# EAGLE design DrivewayLights (EAGLE 7.6.0)
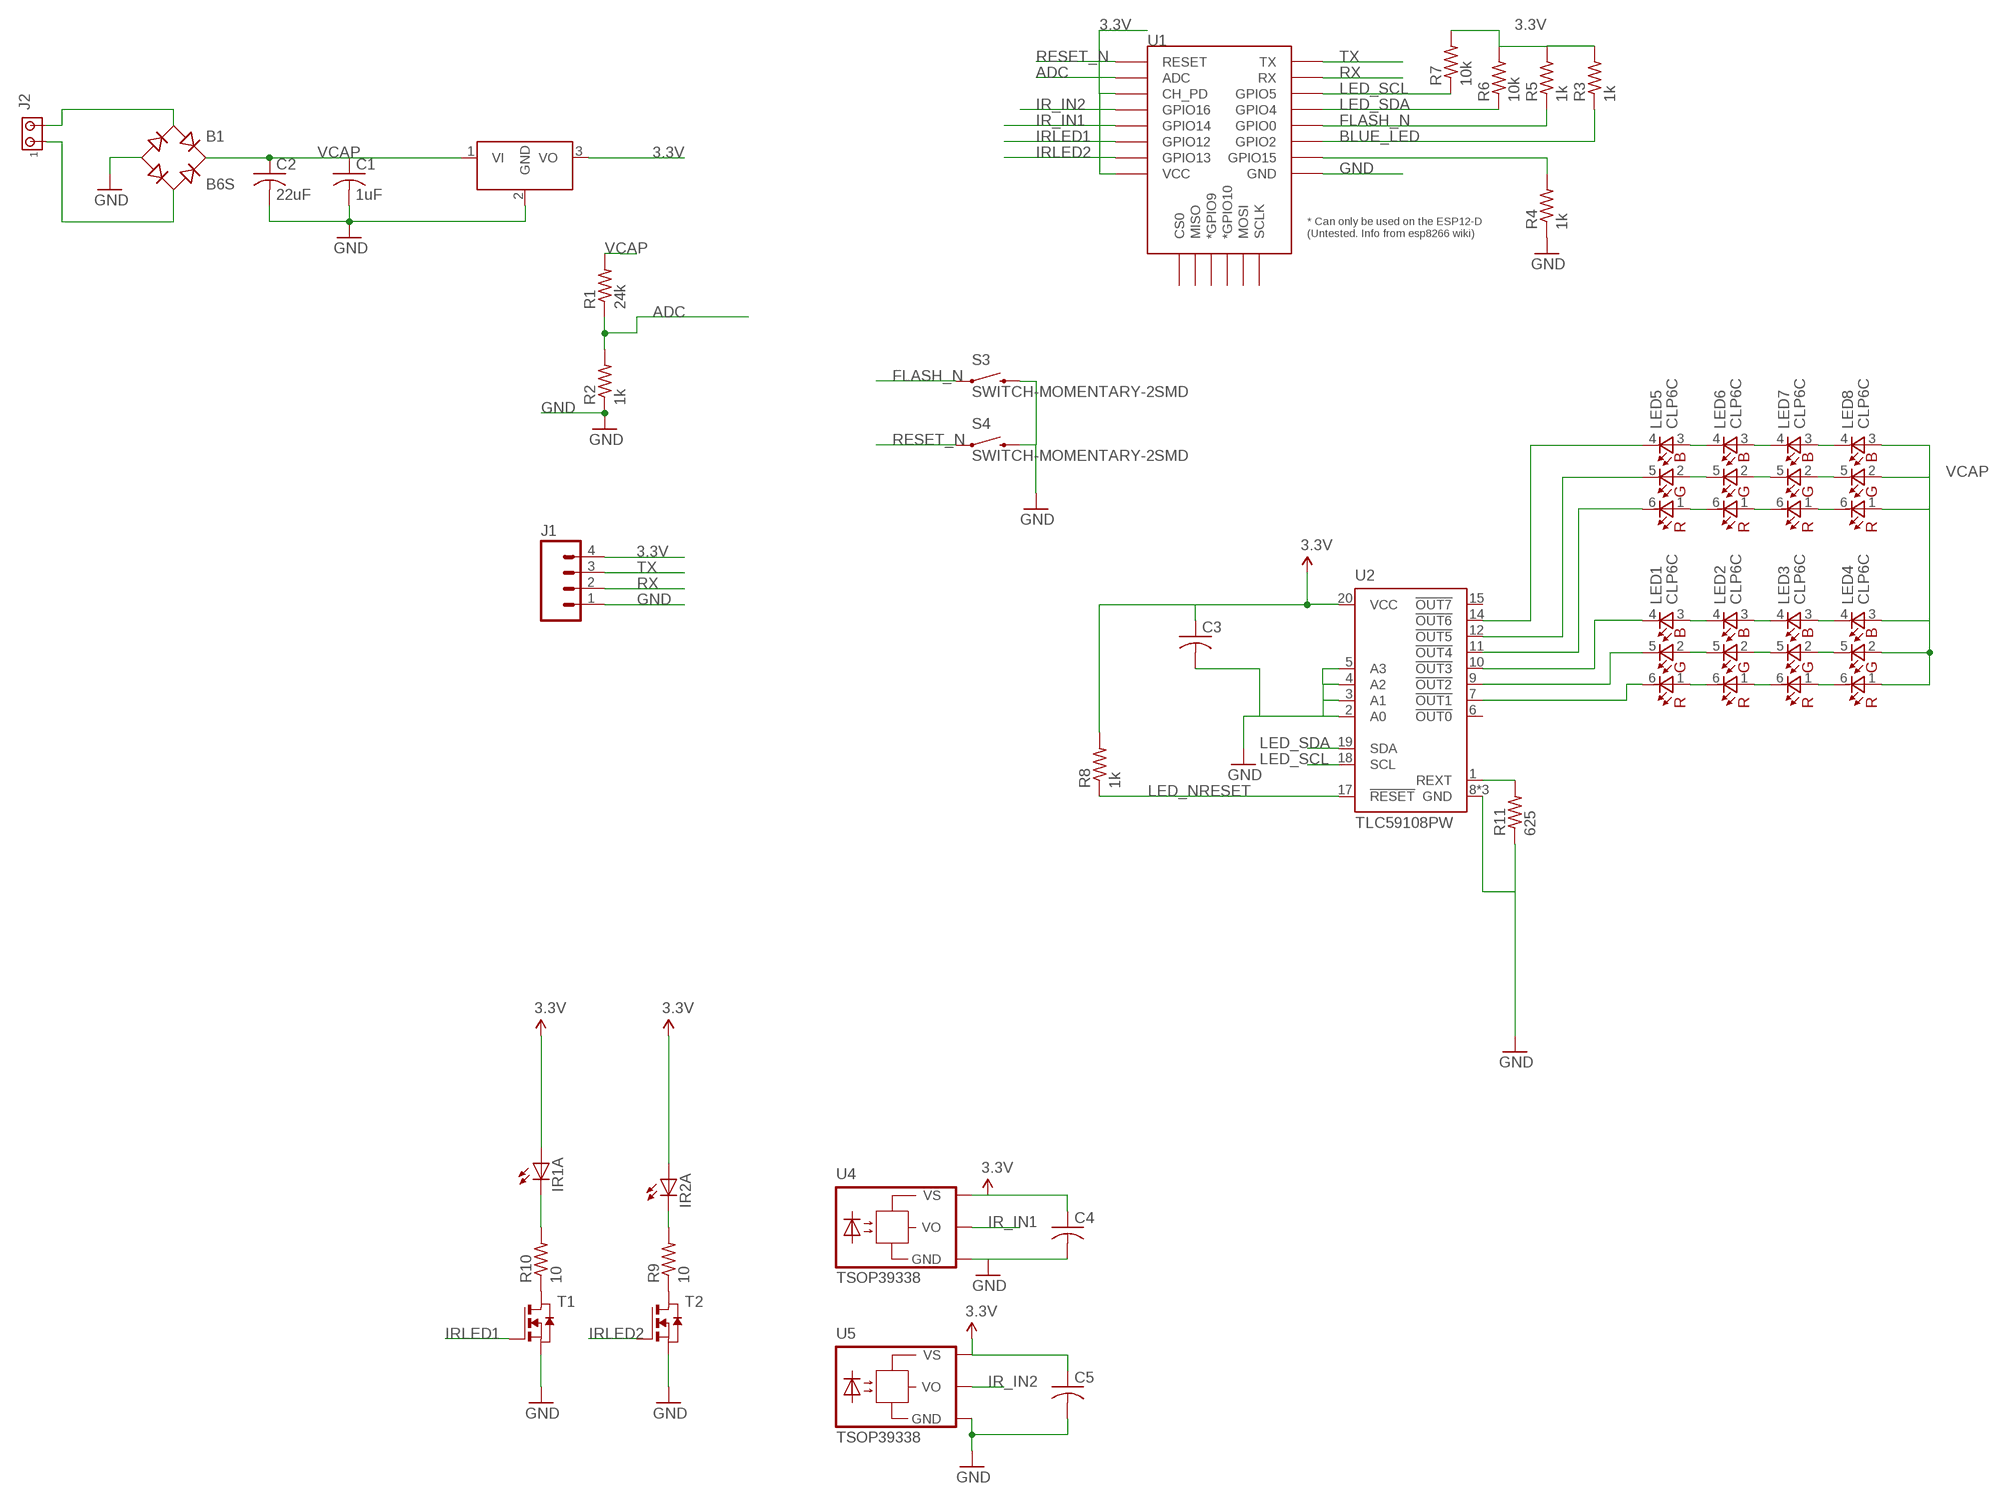
[diagram p0: schematic, sheet 1]

## Parts
B1  B6S  [MBS]
C1  1uF  C-USC0805  [C0805]
C2  22uF  C-USC1210  [C1210]
C3  C-USC0603  [C0603]
C4  C-USC0603  [C0603]
C5  C-USC0603  [C0603]
IR1A  LED5MM  [LED5MM]
IR2A  LED5MM  [LED5MM]
J1  M04JST-PTH-VERT  [JST-4-PTH-VERT]
J2  MTA02-100  [10X02MTA]
LED1  CLP6C  [CLP6C]
LED2  CLP6C  [CLP6C]
LED3  CLP6C  [CLP6C]
LED4  CLP6C  [CLP6C]
LED5  CLP6C  [CLP6C]
LED6  CLP6C  [CLP6C]
LED7  CLP6C  [CLP6C]
LED8  CLP6C  [CLP6C]
R1  24k  R-US_R0603  [R0603]
R2  1k  R-US_R0603  [R0603]
R3  1k  R-US_R0603  [R0603]
R4  1k  R-US_R0603  [R0603]
R5  1k  R-US_R0603  [R0603]
R6  10k  R-US_R0603  [R0603]
R7  10k  R-US_R0603  [R0603]
R8  1k  R-US_R0603  [R0603]
R9  10  R-US_R0603  [R0603]
R10  10  R-US_R0603  [R0603]
R11  625  R-US_R0603  [R0603]
S3  SWITCH-MOMENTARY-2SMD  [TACTILE-SWITCH-SMD]
S4  SWITCH-MOMENTARY-2SMD  [TACTILE-SWITCH-SMD]
T1  NMOSSOT23  [SOT-23]
T2  NMOSSOT23  [SOT-23]
U1  ESP12ESMD  [ESP12E-SMD]
U2  TLC59108PW  [PW_R-PDSO-G20]
U3  DCDC_OKI-78SR  [OKI-78SRH]
U4  TSOP39338  [TSOP39338]
U5  TSOP39338  [TSOP39338]

## Nets
3.3V: C3.1 C4.1 C5.1 IR1A.A IR2A.A J1.4 R3.2 R5.2 R6.2 R7.2 R8.2 U1.CH_PD U1.VCC U2.20(VCC) U3.3(VO) U4.VS U5.VS
ADC: R1.1 R2.2 U1.ADC
BLUE: LED1.4(BC) U2.10(!OUT3)
BLUE2: LED5.4(BC) U2.14(!OUT6)
BLUE_LED: R3.1 U1.GPIO2
FLASH_N: R5.1 S3.1 U1.GPIO0
GND: B1.- C1.2 C2.2 C3.2 C4.2 C5.2 J1.1 R2.1 R4.1 R11.1 S3.3 S4.3 T1.2(S) T2.2(S) U1.GND U2.2(A0) U2.3(A1) U2.4(A2) U2.5(A3) U2.8(GND) U2.13(GND) U2.16(GND) U3.2(GND) U4.GND U5.GND
GREEN: LED1.5(GC) U2.9(!OUT2)
GREEN2: LED5.5(GC) U2.12(!OUT5)
IR_IN1: U1.GPIO14 U4.OUT(VO)
IR_IN2: U1.GPIO16 U5.OUT(VO)
IRLED0: R4.2 U1.GPIO15
IRLED1: T1.3(G) U1.GPIO12
IRLED2: T2.3(G) U1.GPIO13
LED_CURRENT_R: R11.2 U2.1(REXT)
LED_NRESET: R8.1 U2.17(!RESET)
LED_SCL: R7.1 U1.GPIO5 U2.18(SCL)
LED_SDA: R6.1 U1.GPIO4 U2.19(SDA)
N$2: IR2A.K(C) R9.2
N$5: IR1A.K(C) R10.2
N$6: R10.1 T1.1(D)
N$9: R9.1 T2.1(D)
N$12: LED5.3(BA) LED6.4(BC)
N$13: LED6.3(BA) LED7.4(BC)
N$14: LED7.3(BA) LED8.4(BC)
N$15: LED7.2(GA) LED8.5(GC)
N$16: LED6.2(GA) LED7.5(GC)
N$17: LED5.2(GA) LED6.5(GC)
N$18: LED5.1(RA) LED6.6(RC)
N$20: LED6.1(RA) LED7.6(RC)
N$21: LED7.1(RA) LED8.6(RC)
N$25: LED1.3(BA) LED2.4(BC)
N$26: LED2.3(BA) LED3.4(BC)
N$27: LED3.3(BA) LED4.4(BC)
N$28: LED3.2(GA) LED4.5(GC)
N$29: LED2.2(GA) LED3.5(GC)
N$30: LED1.2(GA) LED2.5(GC)
N$31: LED1.1(RA) LED2.6(RC)
N$32: LED2.1(RA) LED3.6(RC)
N$33: LED3.1(RA) LED4.6(RC)
N$39: B1.AC1 J2.2
N$40: B1.AC2 J2.1
RED: LED1.6(RC) U2.7(!OUT1)
RED2: LED5.6(RC) U2.11(!OUT4)
RESET_N: S4.1 U1.RESET
RX: J1.2 U1.RXD0(RX)
TX: J1.3 U1.TXD0(TX)
VCAP: B1.+ C1.1 C2.1 LED4.1(RA) LED4.2(GA) LED4.3(BA) LED8.1(RA) LED8.2(GA) LED8.3(BA) R1.2 U3.1(VI)
Unconnected: U1.CS0 U1.GPIO9(*GPIO9) U1.GPIO10(*GPIO10) U1.MISO U1.MOSI U1.SCLK U2.6(!OUT0) U2.15(!OUT7)

## Library data of the parts
B1 = rectifier:B*S: Surface Mount Glass Passivated Bridge Rectifiers Source: Comchip Bridge Rectifiers B05S-G_B10S-G.pdf
C1-C5 = rcl:C-US: CAPACITOR, American symbol
IR1A IR2A = led:LED: LED OSRAM: - CHIPLED LG R971, LG N971, LY N971, LG Q971, LY Q971, LO R971, LY R971 LH N974, LH R974 LS Q976, LO Q976, LY Q976 LO Q996 - Hyper CHIPLED LW Q18S LB Q993, LB Q99A, LB R99A - SideLED LS A670, LO A670, LY A670, LG A670, LP A670 LB A673, LV A673, LT A673, LW A673 LH A674 LY A675 LS A676, LA A676, LO A676, LY A676, LW A676 LS A679, LY A679, LG A679 - Hyper Micro SIDELED® LS Y876, LA Y876, LO Y876, LY Y876 LT Y87S - SmartLED LW L88C, LW L88S LB L89C, LB L89S, LG L890 LS L89K, LO L89K, LY L89K LS L896, LA L896, LO L896, LY L896 - TOPLED LS T670, LO T670, LY T670, LG T670, LP T670 LSG T670, LSP T670, LSY T670, LOP T670, LYG T670 LG T671, LOG T671, LSG T671 LB T673, LV T673, LT T673, LW T673 LH T674 LS T676, LA T676, LO T676, LY T676, LB T676, LH T676, LSB T676, LW T676 LB T67C, LV T67C, LT T67C, LS T67K, LO T67K, LY T67K, LW E67C LS E67B, LA E67B, LO E67B, LY E67B, LB E67C, LV E67C, LT E67C LW T67C LS T679, LY T679, LG T679 LS T770, LO T770, LY T770, LG T770, LP T770 LB T773, LV T773, LT T773, LW T773 LH T774 LS E675, LA E675, LY E675, LS T675 LS T776, LA T776, LO T776, LY T776, LB T776 LHGB T686 LT T68C, LB T68C - Hyper Mini TOPLED® LB M676 - Mini TOPLED Santana® LG M470 LS M47K, LO M47K, LY M47K Source: http://www.osram.convergy.de LUXEON: - LUMILED® LXK2-PW12-R00, LXK2-PW12-S00, LXK2-PW14-U00, LXK2-PW14-V00 LXK2-PM12-R00, LXK2-PM12-S00, LXK2-PM14-U00 LXK2-PE12-Q00, LXK2-PE12-R00, LXK2-PE12-S00, LXK2-PE14-T00, LXK2-PE14-U00 LXK2-PB12-K00, LXK2-PB12-L00, LXK2-PB12-M00, LXK2-PB14-N00, LXK2-PB14-P00, LXK2-PB14-Q00 LXK2-PR12-L00, LXK2-PR12-M00, LXK2-PR14-Q00, LXK2-PR14-R00 LXK2-PD12-Q00, LXK2-PD12-R00, LXK2-PD12-S00 LXK2-PH12-R00, LXK2-PH12-S00 LXK2-PL12-P00, LXK2-PL12-Q00, LXK2-PL12-R00 Source: www.luxeon.com KINGBRIGHT: KA-3528ASYC Source: www.kingbright.com
J1 = SparkFun-Connectors:M04: Header 4 Standard 4-pin 0.1" header. Use with straight break away headers (SKU : PRT-00116), right angle break away headers (PRT-00553), swiss pins (PRT-00743), machine pins (PRT-00117), and female headers (PRT-00115). Molex polarized connector foot print use with SKU : PRT-08231 with associated crimp pins and housings. 1MM SMD Version SKU: PRT-10208; PROD_ID: CONN-13251
J2 = con-amp:MTA02-100: AMP connector
LED1-LED8 = led:CLP6C; EAGLEUP: PLCC-6-LED
R1-R8 = resistor:R-US_: RESISTOR, American symbol
R9-R11 = rcl:R-US_: RESISTOR, American symbol
S3 S4 = SparkFun-Electromechanical:SWITCH-MOMENTARY-2: Various NO switches- pushbuttons, reed, etc; PROD_ID: SWCH-08247
T1 T2 = zetex:NMOSSOT23: MOS FET; EAGLEUP: SOT23; OC_FARNELL: unknown; OC_NEWARK: unknown
U1 = esp8266modules:ESP12E: ESP12E Module; EAGLEUP: ESP8266-12E
U2 = texas:TLC59108; EAGLEUP: TSSOP20
U3 = rwt-library:DCDC_OKI-78SR: 4.95W DC/DC Converter Manufacturer: Murata Part Number: OKI-78SR-5/1.5-W36H-C OKI-78SR-3.3/1.5-W36H-C
U4 U5 = opto-vishay:TSOP39338

## Board
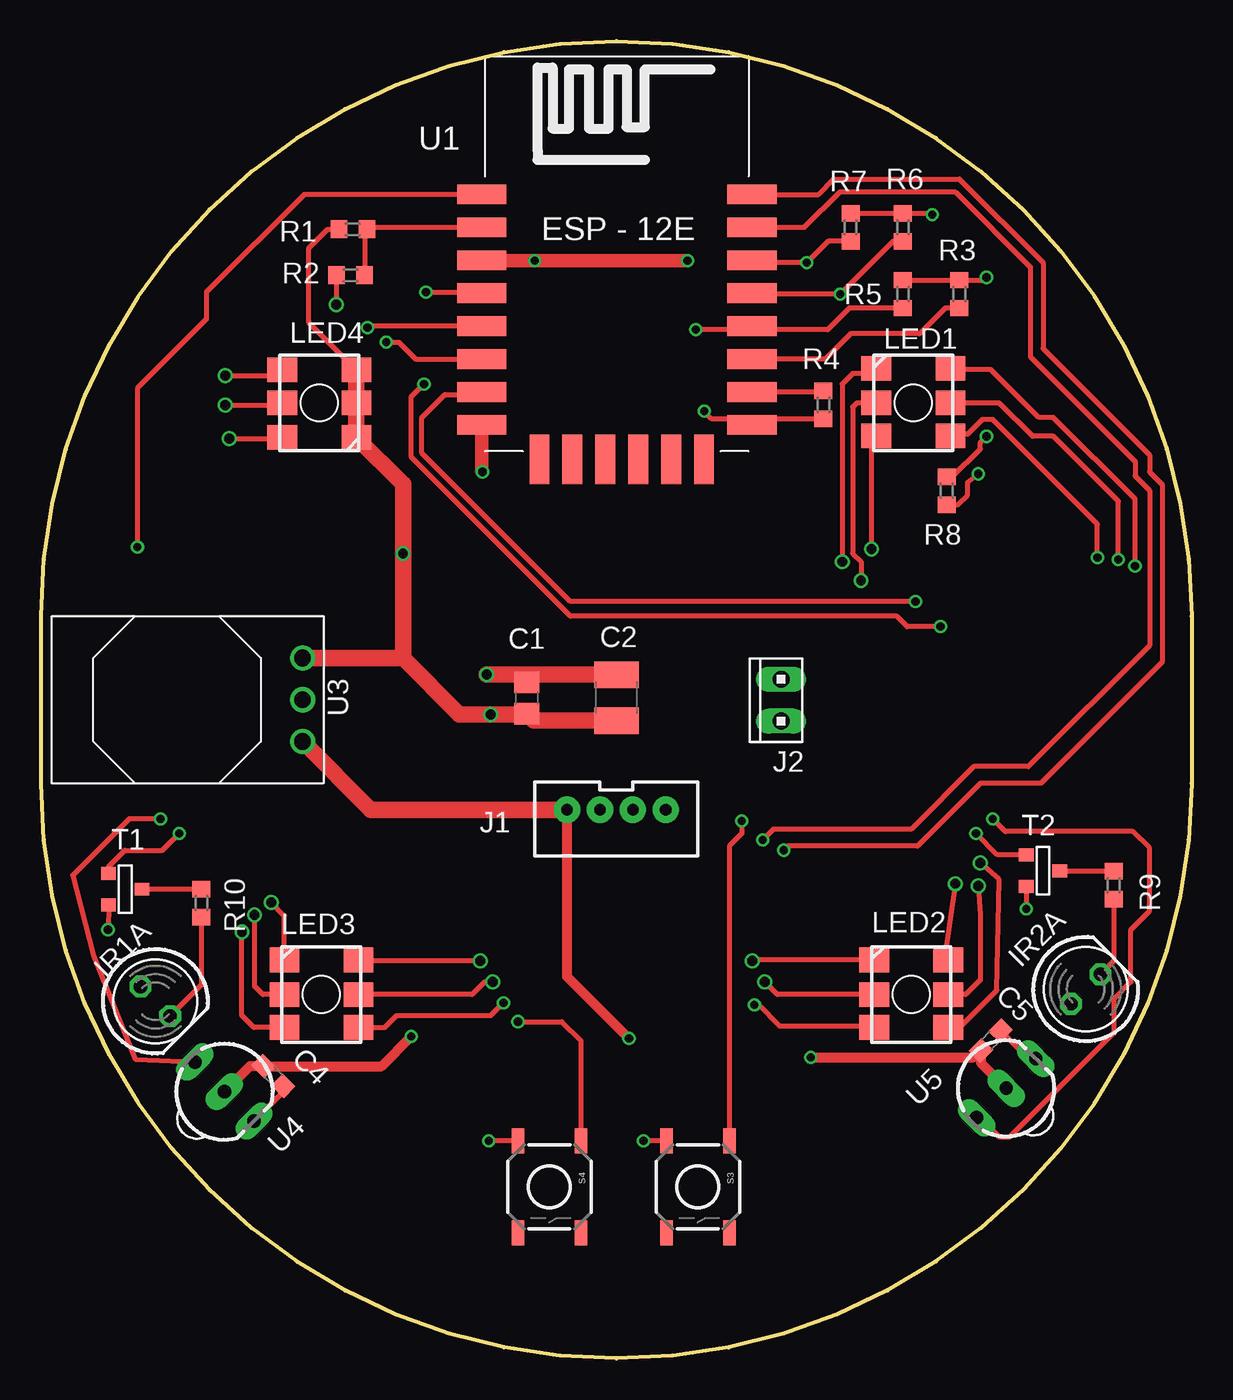
[diagram p1: board, top side]
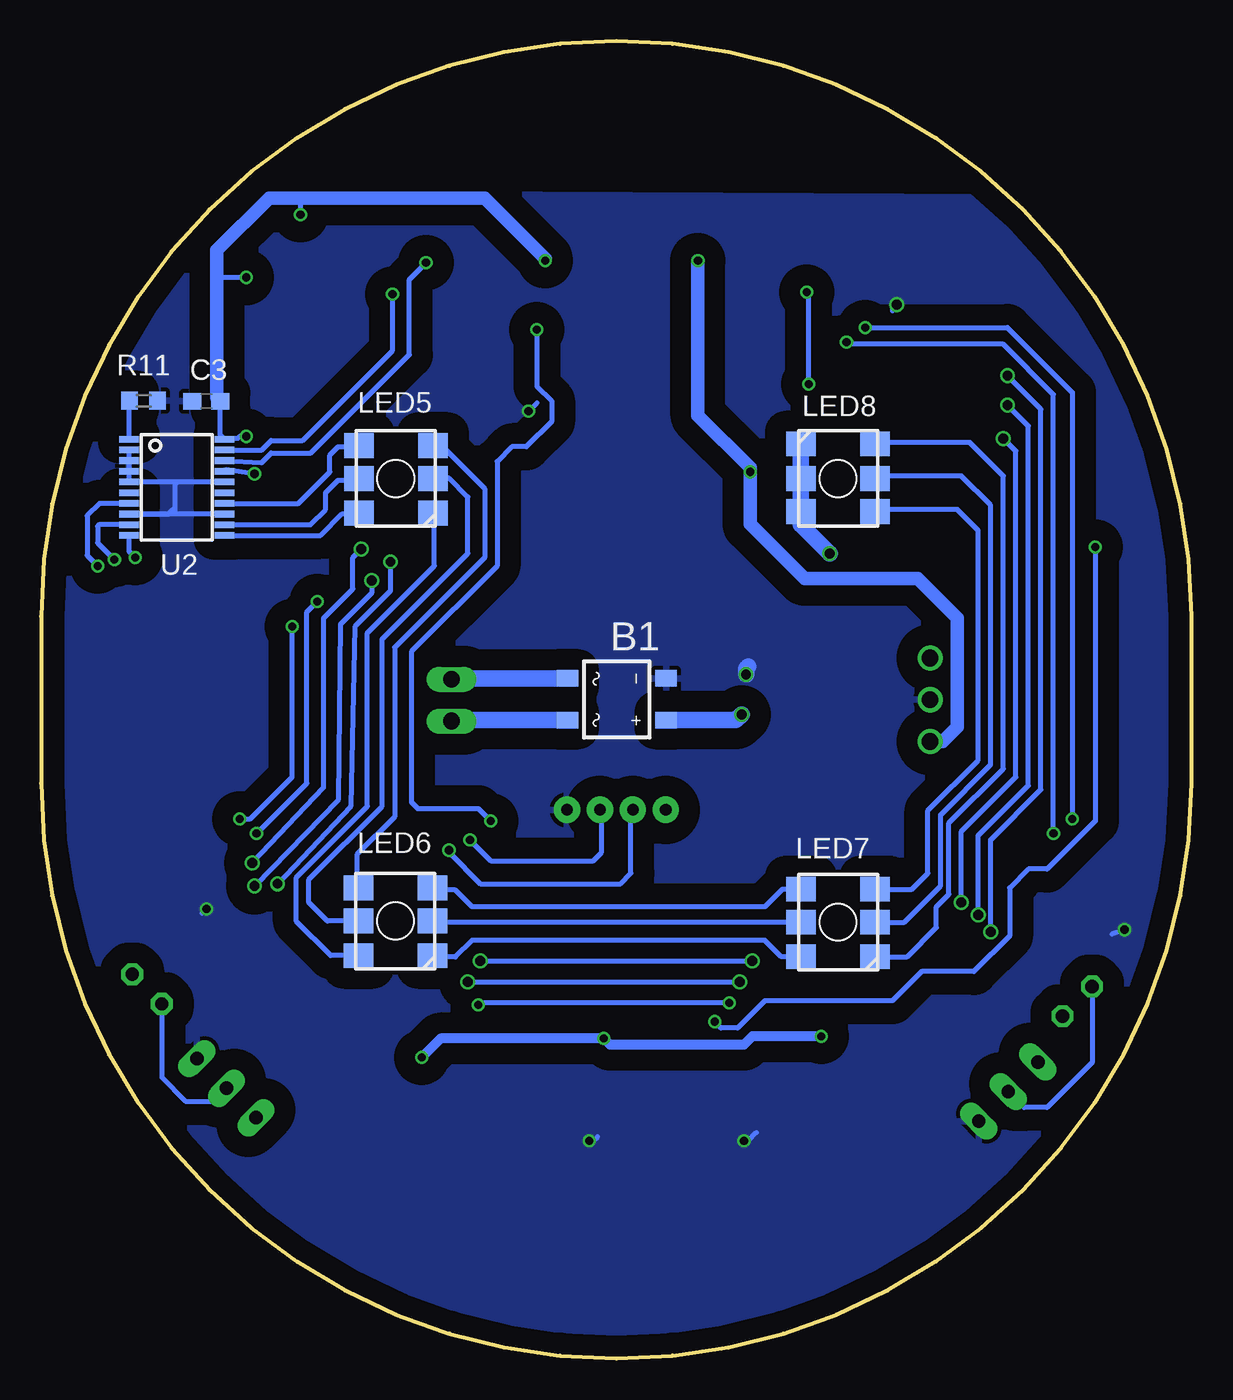
[diagram p2: board, bottom side, seen from below]

Size 69.85 x 80.01 mm. Coordinates in mm from the lower left corner, seen from the top.
Outline: 69.85,34.92 arc-180 0,34.92 0,45.09 arc-180 69.85,45.09 69.85,34.92
Copper layers (1*16): Top 0.035mm / dielectric 1.5mm / Bottom 0.035mm
Design rules "SeeedStudio_2layer_DRU_no_angle_20140221 *": minimum track width 12mil, minimum drill 12mil, track to track 6mil, track to pad 6mil, pad to pad 6mil, via to via 6mil, smd to smd 0mil, copper to edge 10mil, drill to drill 10mil, minimum pad ring 10mil, minimum via ring 6mil, stop-mask expansion 2mil, vias tented up to drill 100mil, thermal gap 10mil

### Footprints (pad centres in the part's own frame; a part is rotated, then mirrored left to right if it is on the bottom)
MBS = smd 1 x 1.3: + -1.27,-3; - 1.27,-3; AC1 -1.27,3; AC2 1.27,3
C0805 = smd 1.3 x 1.5: 1 -0.95,0; 2 0.95,0
C1210 = smd 1.6 x 2.7: 1 -1.4,0; 2 1.4,0
C0603 = smd 1.1 x 1: 1 -0.85,0; 2 0.85,0
LED5MM = drill 0.813 octagon: A -1.27,0; K 1.27,0
JST-4-PTH-VERT = drill 0.7 pad 1.6: 1 -3,-0.55; 2 -1,-0.55; 3 1,-0.55; 4 3,-0.55
10X02MTA = drill 1.016 long: 1 1.27,0; 2 -1.27,0
CLP6C = smd 1.8 x 1.5: 1 -2.25,2.1; 2 -2.25,0; 3 -2.25,-2; 4 2.25,-2; 5 2.25,0; 6 2.25,2.1
R0603 = smd 1 x 1.1: 1 -0.85,0; 2 0.85,0
TACTILE-SWITCH-SMD = smd 1.524 x 0.762: 1 -2.794,1.905; 2 2.794,1.905; 3 -2.794,-1.905; 4 2.794,-1.905
SOT-23 = smd 0.787 x 0.889: 1 0.025,-1.016; 2 -0.94,1.016; 3 0.991,1.016
ESP12E-SMD = smd 3 x 1.2: ADC -8.3,3.8; CH_PD -8.3,1.8; GND 8.1,-8.2; GPIO0 8.1,-2.2; GPIO2 8.1,-4.2; GPIO4 8.1,-0.2; GPIO5 8.1,1.8; GPIO12 -8.3,-4.2; GPIO13 -8.3,-6.2; GPIO14 -8.3,-2.2; GPIO15 8.1,-6.2; GPIO16 -8.3,-0.2; RESET -8.3,5.8; RXD0 8.1,3.8; TXD0 8.1,5.8; VCC -8.3,-8.2 | smd 1.2 x 3: CS0 -4.8,-10.3; GPIO9 -0.8,-10.3; GPIO10 1.2,-10.3; MISO -2.8,-10.3; MOSI 3.2,-10.3; SCLK 5.2,-10.3
PW_R-PDSO-G20 = smd 0.4 x 1.2: 1 -2.925,-2.9; 2 -2.275,-2.9; 3 -1.625,-2.9; 4 -0.975,-2.9; 5 -0.325,-2.9; 6 0.325,-2.9; 7 0.975,-2.9; 8 1.625,-2.9; 9 2.275,-2.9; 10 2.925,-2.9; 11 2.925,2.9; 12 2.275,2.9; 13 1.625,2.9; 14 0.975,2.9; 15 0.325,2.9; 16 -0.325,2.9; 17 -0.975,2.9; 18 -1.625,2.9; 19 -2.275,2.9; 20 -2.925,2.9
OKI-78SRH = drill 1.016: 1 2.54,0; 2 0,0; 3 -2.54,0
TSOP39338 = drill 0.813 long: GND 2.54,0; OUT -2.54,0; VS 0,0

### Placement (x,y rotation side)
B1  34.9,40.03 90 bottom
C1  29.49,40.11 90 top
C2  34.92,40.13 90 top
C3  59.82,58.14 180 bottom
C4  14.1,17.14 315 top
C5  57.66,19.3 45 top
IR1A  6.93,21.69 315 top
IR2A  63.42,22.43 45 top
J1  34.92,32.77 180 top
J2  44.93,39.98 90 top
LED1  52.96,58.04 0 top
LED2  52.83,22.1 0 top
LED3  17.02,22.1 0 top
LED4  16.89,58.04 180 top
LED5  48.31,53.44 180 bottom
LED6  48.34,26.57 180 bottom
LED7  21.46,26.49 180 bottom
LED8  21.46,53.44 0 bottom
R1  18.92,68.58 180 top
R2  18.8,65.79 0 top
R3  55.75,64.64 90 top
R4  47.5,57.91 90 top
R5  52.32,64.64 90 top
R6  52.32,68.71 90 top
R7  49.15,68.71 90 top
R8  54.99,52.7 90 top
R9  65.13,28.73 270 top
R10  9.73,27.66 270 top
R11  63.63,58.17 180 bottom
S3  39.88,10.41 270 top
S4  30.86,10.41 270 top
T1  5.11,28.47 90 top
T2  60.83,29.59 90 top
U1  35.05,64.9 0 top
U2  61.62,52.91 270 bottom
U3  15.88,40.01 90 top
U4  11.13,16.21 315 top
U5  58.6,16.41 45 top

### Tracks (layer width: path | path; a pad name or v marks a point on that pad's centre or on a via)
3.3V  (via drill 0.5)
  Top 0.305: v57.4,65.66 57.24,65.49 R3.2 R5.2 | R7.2 R6.2 54.01,69.56 v54.1,69.47 | R8.2 55.33,53.55 57.02,55.24 57.02,55.63 v57.4,56.01
  Top 0.61: J1.4 31.93,23.19 v35.69,19.43 | v46.74,18.29 56.64,18.29 C5.1 57.06,17.95 U5.VS | U4.VS 12.67,17.75 C4.1 20.67,17.75 v22.48,19.56
  Top 0.813: U1.CH_PD 26.77,66.67 v29.97,66.67 v39.24,66.67 | U1.VCC 26.75,53.89 v26.8,53.85
  Top 1.016: J1.4 20.02,33.32 U3.3
  Bottom 0.305: U2.20 58.97,56.08 C3.1 | 58.64,55.75 U2.20 | IR1A.A 6.04,17.97 8.76,15.24 10.16,15.24 U4.VS | v57.4,65.66 59.05,65.66 59.18,65.79 | v54.1,69.47 54.1,70.48 | IR2A.A 62.53,17.06 61.09,15.62 59.38,15.62 U5.VS | v57.4,56.01 57.78,56.01 57.91,55.88 58.67,55.88 U2.20
  Bottom 0.61: v46.74,18.29 45.59,19.43 v35.69,19.43 35.31,19.05 27.18,19.05 26.67,19.56 v22.48,19.56
  Bottom 0.813: v29.97,66.67 29.97,57.28 26.8,54.1 v26.8,53.85 26.8,50.67 23.5,47.37 16.64,47.37 14.22,44.96 14.22,38.35 15.11,37.47 U3.3 | v39.24,66.67 39.24,66.8 42.93,70.48 54.1,70.48 56.01,70.48 59.18,67.31 59.18,65.79 59.18,58.36 C3.1
ADC
  Top 0.305: R2.2 19.65,68.45 R1.1 19.89,68.7 U1.ADC
BLUE  (via drill 0.5)
  Top 0.305: v64.14,48.64 64.14,50.67 57.78,57.02 57.15,57.02 56.26,56.13 55.3,56.13 LED1.4
  Bottom 0.305: U2.10 64.52,49.03 v64.14,48.64
BLUE2
  Bottom 0.305: U2.14 54.24,51.93 52.32,53.85 52.32,54.86 51.82,55.37 50.63,55.37 LED5.4
BLUE_LED
  Top 0.305: R3.1 54.9,63.79 53.34,62.23 49.15,62.23 47.62,60.71 43.16,60.71 U1.GPIO2
FLASH_N  (via drill 0.5)
  Top 0.305: R5.1 49.06,63.79 47.75,62.48 43.37,62.48 | 43.37,62.48 U1.GPIO0 | 43.37,62.48 v39.75,62.48 | v42.55,32.64 42.55,31.88 41.78,31.11 S3.1
  Bottom 0.305: v39.75,62.48 39.75,59.05 38.86,58.17 38.86,56.9 40.39,55.37 41.27,55.37 42.16,54.48 42.16,48.13 47.37,42.93 47.37,33.78 46.99,33.4 43.31,33.4 v42.55,32.64
GND  (via drill 0.5, 0.6)
  Top 0.305: R2.1 17.91,65.75 v17.91,64.01 | U1.GND 43.52,57.06 | 43.52,57.06 40.73,57.06 v40.26,57.53 | R4.1 43.52,57.06 | T1.2 v4.06,26.04 | C4.2 14.7,16.19 U4.GND | S4.3 v27.18,13.21 | S3.3 v36.58,13.21 | U5.GND 59.96,18.2 C5.2 | T2.2 v59.82,27.3
  Top 1.016: C2.2 29.96,41.53 | 29.96,41.53 C1.2 | 29.96,41.53 v27.05,41.53
  Bottom 0.305: v17.91,64.01 18.16,63.75 18.16,63.63 | U2.13 U2.8 62.13,51.28 61.85,51.56 61.72,51.44 61.72,53.11 61.59,53.23 | U2.16 61.59,53.23 | 61.59,53.23 U2.5 U2.4 U2.3 U2.2 | v40.26,57.53 39.75,58.04 | v4.06,26.04 4.83,25.78 | v27.18,13.21 26.92,13.21 26.42,13.72 | v36.58,13.21 36.32,13.21 36.07,13.46 | v59.82,27.3 60.07,27.05
  Bottom 1.016: v27.05,41.53 27.05,41.91 26.92,42.04
  pour Bottom (isolate 1.27): 1.02,70.48 72.39,70.87 71.12,-4.32 -1.02,-4.32 -1.4,38.61 -12.57,37.85 -12.57,70.36
GREEN  (via drill 0.5)
  Top 0.305: v65.41,48.51 65.41,52.07 61.47,56.01 60.2,56.01 58.17,58.04 LED1.5
  Bottom 0.305: U2.9 66.33,50.63 66.42,50.55 66.42,49.53 v65.41,48.51
GREEN2
  Bottom 0.305: U2.12 53.51,50.63 52.58,51.56 52.58,52.58 51.82,53.34 50.66,53.34 LED5.5
IR_IN1  (via drill 0.5)
  Top 0.305: U1.GPIO14 19.9,62.7 v19.81,62.61 | v7.24,32.77 5.33,32.77 1.91,29.34 3.17,24.51 5.71,18.16 U4.OUT
  Bottom 0.305: v19.81,62.61 11.18,62.61 7.24,58.67 v7.24,32.77
IR_IN2  (via drill 0.5)
  Top 0.305: U5.OUT 57.02,14.61 58.17,13.46 58.8,13.46 65.15,19.81 65.15,21.84 66.17,22.86 66.17,26.04 67.31,27.18 67.31,30.99 66.29,32 58.55,32 v57.78,32.77 | v54.61,44.45 52.58,44.45 51.94,45.09 32.13,45.09 22.48,54.74 22.48,58.42 v23.24,59.18 | v23.37,64.77 26.68,64.77 U1.GPIO16
  Bottom 0.305: v57.78,32.77 57.15,32.77 54.61,35.31 v54.61,44.45 | v23.24,59.18 23.24,64.64 v23.37,64.77
IRLED0
  Top 0.305: R4.2 47.43,58.7 U1.GPIO15
IRLED1  (via drill 0.5)
  Top 0.305: T1.3 4.09,29.87 5.08,30.86 7.37,30.86 v8.38,31.88 | v20.95,61.72 21.72,61.72 22.73,60.71 U1.GPIO12
  Bottom 0.305: v8.38,31.88 8.38,58.55 11.43,61.59 20.83,61.59 v20.95,61.72
IRLED2  (via drill 0.5)
  Top 0.305: T2.3 58.06,30.58 v56.77,31.88 | v53.09,45.97 32.13,45.97 23.11,54.99 23.11,57.15 24.51,58.55 26.6,58.55 U1.GPIO13
  Bottom 0.305: v56.77,31.88 53.72,34.92 53.72,45.34 v53.09,45.97
LED_CURRENT_R
  Bottom 0.305: R11.2 64.52,58.12 U2.1
LED_NRESET  (via drill 0.5)
  Top 0.305: R8.1 55.66,51.85 56.26,52.45 56.26,53.21 v56.9,53.72
  Bottom 0.305: v56.9,53.72 58.63,53.98 U2.17
LED_SCL  (via drill 0.5)
  Top 0.305: U1.GPIO5 43.3,66.55 v46.48,66.55 47.79,67.86 R7.1
  Bottom 0.305: U2.18 56.47,54.41 55.88,54.99 53.47,54.99 47.5,60.96 47.5,65.53 v46.48,66.55
LED_SDA  (via drill 0.5)
  Top 0.305: U1.GPIO4 43.21,64.64 v48.51,64.64 51.73,67.86 R6.1
  Bottom 0.305: U2.19 56.45,55.18 55.88,55.75 53.98,55.75 48.51,61.21 v48.51,64.64
N$2
  Top 0.305: R9.2 65.13,24.13 IR2A.K
N$5
  Top 0.305: R10.2 9.73,22.69 IR1A.K
N$6
  Top 0.305: T1.1 9.72,28.5 R10.1
N$9
  Top 0.305: T2.1 65.09,29.62 R9.1
N$12
  Bottom 0.305: LED5.3 45.54,55.44 42.93,52.83 42.93,48.64 48.39,43.18 48.39,32.89 50.67,30.61 50.67,28.66 LED6.4
N$13
  Bottom 0.305: LED7.4 24.85,28.49 25.91,27.43 43.69,27.43 44.7,28.45 45.97,28.45 LED6.3
N$14
  Bottom 0.305: LED7.3 16.97,28.49 16,29.46 16,33.27 12.95,36.32 12.95,50.29 14.22,51.56 19.09,51.56 LED8.4
N$15
  Bottom 0.305: LED7.2 17.45,26.49 15.24,28.7 15.24,33.02 12.19,36.07 12.19,51.82 13.97,53.59 19.06,53.59 LED8.5
N$16
  Bottom 0.305: LED7.5 46.01,26.49 LED6.2
N$17
  Bottom 0.305: LED6.5 52.48,26.57 53.59,27.69 53.59,29.08 49.15,33.53 49.15,43.69 43.94,48.9 43.94,52.32 45.09,53.47 46.03,53.47 LED5.2
N$18
  Bottom 0.305: LED6.6 52.28,24.47 54.36,26.54 54.36,29.21 50.04,33.53 50.04,44.07 45.97,48.13 45.97,51.26 LED5.1
N$20
  Bottom 0.305: LED7.6 24.9,24.39 25.91,25.4 43.69,25.4 44.7,24.38 46,24.38 LED6.1
N$21
  Bottom 0.305: LED7.1 17.26,24.39 15.49,26.16 15.49,27.43 14.73,28.19 14.73,32.51 11.43,35.81 11.43,53.59 13.46,55.63 19.13,55.63 LED8.6
N$25  (via drill 0.6)
  Top 0.305: LED2.4 55.78,20.1 58.04,22.35 58.17,29.08 v57.02,30.1 | v50.42,49.15 50.42,55.75 LED1.3
  Bottom 0.305: v57.02,30.1 52.7,34.67 52.7,44.96 50.93,46.74 50.93,48.64 v50.42,49.15
N$26  (via drill 0.5)
  Top 0.305: LED3.4 20.86,20.1 21.59,20.83 27.3,20.83 v28.07,21.59 | v43.31,21.46 43.56,21.46 44.83,20.19 50.49,20.19 LED2.3
  Bottom 0.305: v28.07,21.59 43.18,21.59 v43.31,21.46
N$27  (via drill 0.6)
  Top 0.305: LED3.3 12.92,20.1 12.19,20.83 v12.19,25.91 | v11.18,59.69 14.29,59.69 LED4.4
  Bottom 0.305: v12.19,25.91 12.19,31.5 9.14,34.54 9.14,57.66 v11.18,59.69
N$28  (via drill 0.6)
  Top 0.305: LED3.2 13.46,22.1 12.95,22.61 v12.95,26.92 | v11.18,57.91 14.51,57.91 LED4.5
  Bottom 0.305: v12.95,26.92 12.95,31.75 9.91,34.8 9.91,56.64 v11.18,57.91
N$29  (via drill 0.6)
  Top 0.305: LED2.2 44.7,22.1 v43.94,22.86 | v27.43,22.86 26.92,22.86 26.16,22.1 LED3.5
  Bottom 0.305: v43.94,22.86 v27.43,22.86
N$30  (via drill 0.6)
  Top 0.305: LED1.2 49.53,58.04 49.28,57.78 49.28,48.9 49.78,48.39 v49.78,47.24 | v56.9,28.7 57.02,26.92 57.02,22.99 56.13,22.1 LED2.5
  Bottom 0.305: v49.78,47.24 49.78,46.48 51.69,44.58 51.82,33.91 v56.9,28.7
N$31  (via drill 0.6)
  Top 0.305: LED1.1 50.39,59.82 49.28,59.82 48.64,59.18 v48.64,48.39 | v55.5,28.83 54.86,24.42 LED2.6
  Bottom 0.305: v48.64,48.39 48.64,46.61 50.8,44.45 51.05,33.53 v55.5,28.83
N$32  (via drill 0.6)
  Top 0.305: LED2.1 43.25,24.2 v43.18,24.13 | v26.67,24.13 19.34,24.13 LED3.6
  Bottom 0.305: v43.18,24.13 v26.67,24.13
N$33  (via drill 0.6)
  Top 0.305: LED3.1 14.77,26.89 v13.97,27.69 | v11.43,55.88 14.58,55.88 LED4.6
  Bottom 0.305: v13.97,27.69 13.97,32 10.67,35.31 10.67,55.12 v11.43,55.88
N$39
  Bottom 1.016: B1.AC1 44.88,38.76 J2.2
N$40
  Bottom 1.016: B1.AC2 44.88,41.3 J2.1
RED  (via drill 0.5)
  Top 0.305: v66.42,48.13 66.42,52.2 61.47,57.15 60.58,57.15 57.66,60.07 55.28,60.07 LED1.6
  Bottom 0.305: U2.7 66.3,51.93 67.06,51.18 67.06,48.77 v66.42,48.13
RED2
  Bottom 0.305: U2.11 52.89,49.98 51.56,51.31 50.59,51.31 LED5.6
RESET_N  (via drill 0.5)
  Top 0.305: U1.RESET 15.96,70.7 10.03,64.77 10.03,63.12 5.84,58.93 v5.84,49.28 | v28.96,20.45 31.62,20.45 32.77,19.3 S4.1
  Bottom 0.305: v28.96,20.45 28.57,20.07 27.56,20.07 25.91,21.72 18.16,21.72 16.38,23.5 13.21,23.5 11.05,25.65 11.05,28.57 9.91,29.72 8.76,29.72 5.84,32.64 v5.84,49.28
RX  (via drill 0.5)
  Top 0.305: U1.RXD0 46.34,68.7 48.51,70.87 55.5,70.87 60.07,66.29 60.07,60.83 66.42,54.48 66.42,53.59 67.31,52.7 67.31,43.31 59.94,35.94 56.64,35.94 52.83,32.13 44.45,32.13 v43.81,31.5 | 35.94,33.3 J1.2
  Bottom 0.305: v43.81,31.5 42.55,30.23 36.32,30.23 35.81,30.73 35.81,33.2 J1.2
TX  (via drill 0.5)
  Top 0.305: U1.TXD0 47.2,70.7 48.13,71.63 55.75,71.63 60.83,66.55 60.83,61.34 67.31,54.86 67.31,53.85 68.07,53.09 68.07,42.29 60.71,34.92 57.02,34.92 53.21,31.11 45.34,31.11 v45.09,30.86 | 34.04,33.2 J1.3
  Bottom 0.305: v45.09,30.86 45.09,30.73 43.18,28.83 34.67,28.83 34.04,29.46 34.04,33.2 J1.3
VCAP  (via drill 0.6)
  Top 0.305: LED4.3 16.26,62.92 16.26,67.44 17.4,68.58 R1.2
  Top 1.016: C2.1 29.91,38.73 C1.1 29.45,39.12 v27.3,39.12 25.4,39.12 21.97,42.55 | U3.1 21.97,42.55 | 21.97,42.55 v21.97,48.9 21.97,53.11 LED4.1 LED4.2 LED4.3
  Bottom 1.016: B1.+ 27.66,38.76 v27.3,39.12 | LED8.3 LED8.2 | LED8.2 LED8.1 | LED8.2 23.71,50.64 v21.97,48.9